# EAGLE design AVRI2CIO_V0_2_LEVEL0 (EAGLE 6.6.0)
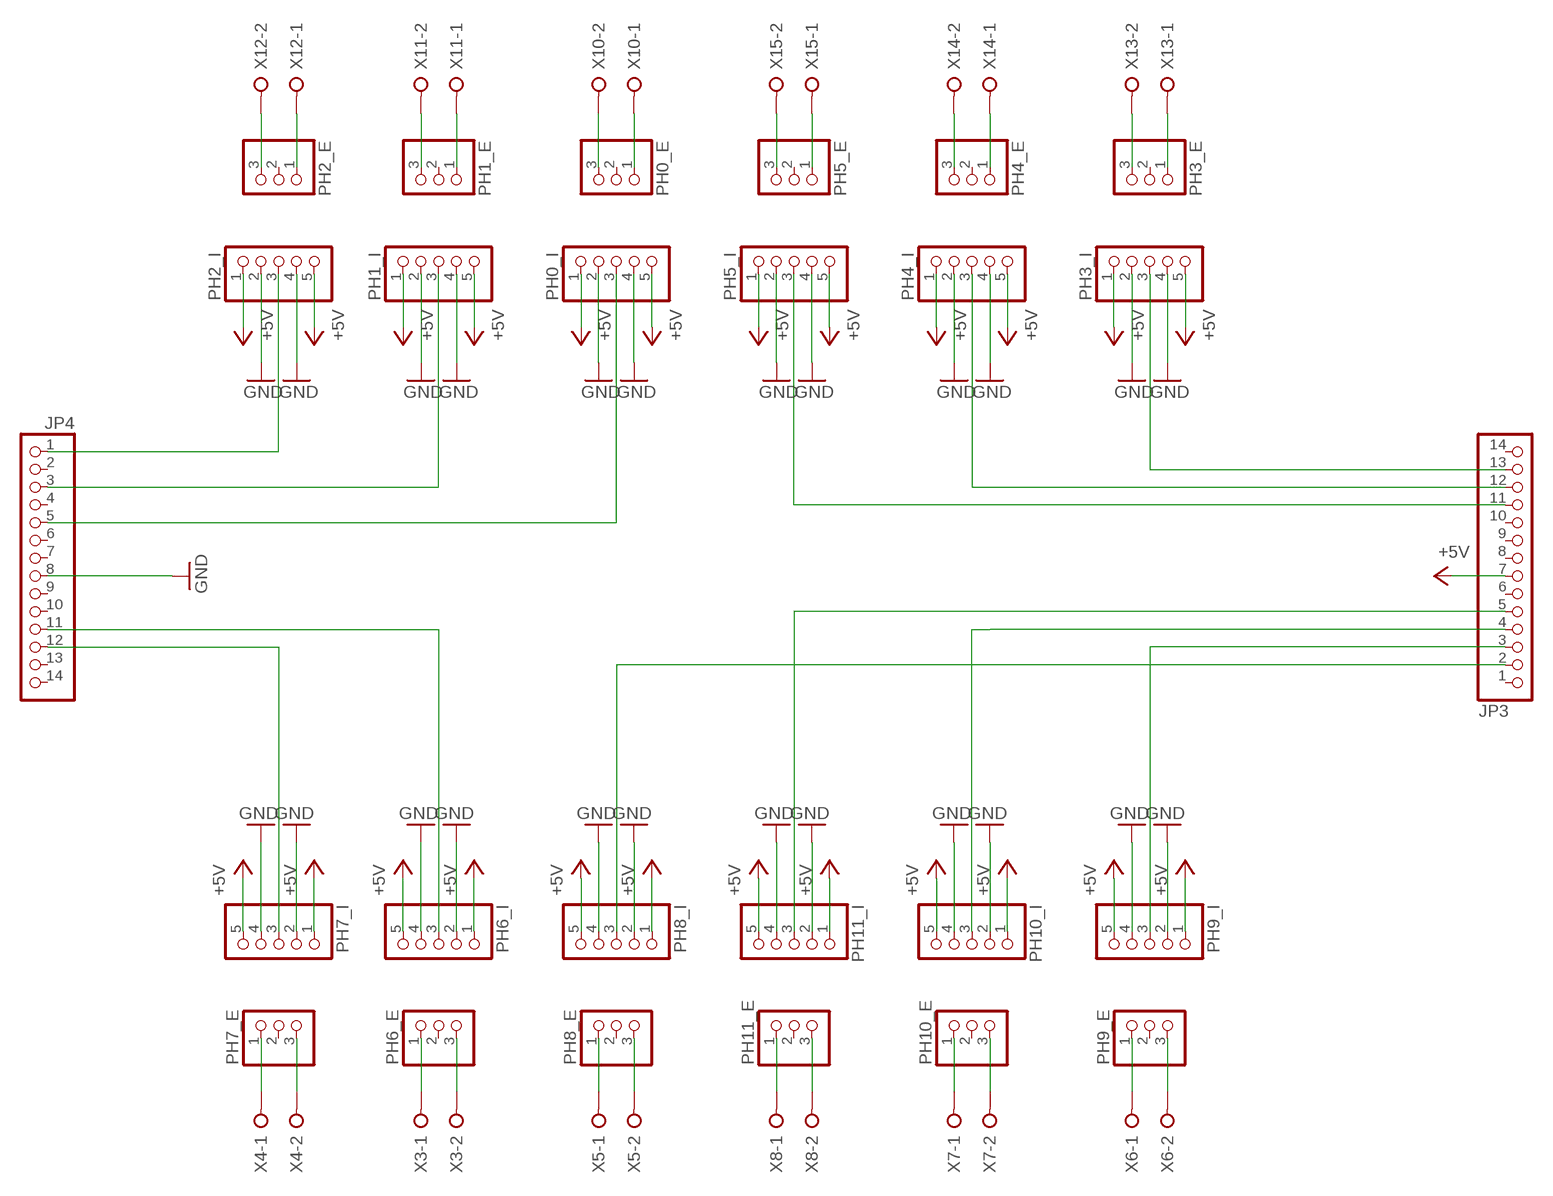
[diagram p0: schematic, sheet 1]

## Parts
JP3  PINHD-1X14  [1X14]
JP4  PINHD-1X14  [1X14]
PH0_E  PINHD-1X3  [1X03]
PH0_I  PINHD-1X5  [1X05]
PH1_E  PINHD-1X3  [1X03]
PH1_I  PINHD-1X5  [1X05]
PH2_E  PINHD-1X3  [1X03]
PH2_I  PINHD-1X5  [1X05]
PH3_E  PINHD-1X3  [1X03]
PH3_I  PINHD-1X5  [1X05]
PH4_E  PINHD-1X3  [1X03]
PH4_I  PINHD-1X5  [1X05]
PH5_E  PINHD-1X3  [1X03]
PH5_I  PINHD-1X5  [1X05]
PH6_E  PINHD-1X3  [1X03]
PH6_I  PINHD-1X5  [1X05]
PH7_E  PINHD-1X3  [1X03]
PH7_I  PINHD-1X5  [1X05]
PH8_E  PINHD-1X3  [1X03]
PH8_I  PINHD-1X5  [1X05]
PH9_E  PINHD-1X3  [1X03]
PH9_I  PINHD-1X5  [1X05]
PH10_E  PINHD-1X3  [1X03]
PH10_I  PINHD-1X5  [1X05]
PH11_E  PINHD-1X3  [1X03]
PH11_I  PINHD-1X5  [1X05]
X3  W237-02P  [W237-132]
X4  W237-02P  [W237-132]
X5  W237-02P  [W237-132]
X6  W237-02P  [W237-132]
X7  W237-02P  [W237-132]
X8  W237-02P  [W237-132]
X10  W237-02P  [W237-132]
X11  W237-02P  [W237-132]
X12  W237-02P  [W237-132]
X13  W237-02P  [W237-132]
X14  W237-02P  [W237-132]
X15  W237-02P  [W237-132]

## Nets
+5V: JP3.7 PH0_I.1 PH0_I.5 PH1_I.1 PH1_I.5 PH2_I.1 PH2_I.5 PH3_I.1 PH3_I.5 PH4_I.1 PH4_I.5 PH5_I.1 PH5_I.5 PH6_I.1 PH6_I.5 PH7_I.1 PH7_I.5 PH8_I.1 PH8_I.5 PH9_I.1 PH9_I.5 PH10_I.1 PH10_I.5 PH11_I.1 PH11_I.5
GND: JP4.8 PH0_I.2 PH0_I.4 PH1_I.2 PH1_I.4 PH2_I.2 PH2_I.4 PH3_I.2 PH3_I.4 PH4_I.2 PH4_I.4 PH5_I.2 PH5_I.4 PH6_I.2 PH6_I.4 PH7_I.2 PH7_I.4 PH8_I.2 PH8_I.4 PH9_I.2 PH9_I.4 PH10_I.2 PH10_I.4 PH11_I.2 PH11_I.4
N$1: PH0_E.3 X10.2
N$2: PH0_E.1 X10.1
N$3: PH6_E.3 X3.2
N$4: PH6_E.1 X3.1
N$5: PH7_E.3 X4.2
N$6: PH7_E.1 X4.1
N$7: PH8_E.3 X5.2
N$8: PH8_E.1 X5.1
N$9: PH9_E.3 X6.2
N$10: PH9_E.1 X6.1
N$11: PH10_E.3 X7.2
N$12: PH10_E.1 X7.1
N$13: PH11_E.3 X8.2
N$14: PH11_E.1 X8.1
N$16: JP4.12 PH7_I.3
N$17: JP3.11 PH5_I.3
N$18: JP3.3 PH9_I.3
N$19: PH1_E.1 X11.1
N$20: PH1_E.3 X11.2
N$21: JP3.2 PH8_I.3
N$22: JP3.13 PH3_I.3
N$23: PH2_E.1 X12.1
N$24: PH2_E.3 X12.2
N$25: PH3_E.1 X13.1
N$26: PH3_E.3 X13.2
N$27: PH4_E.1 X14.1
N$28: PH4_E.3 X14.2
N$29: PH5_E.1 X15.1
N$30: PH5_E.3 X15.2
N$31: JP3.12 PH4_I.3
N$32: JP4.3 PH1_I.3
N$34: JP4.11 PH6_I.3
N$35: JP4.5 PH0_I.3
N$36: JP4.1 PH2_I.3
PD3: JP3.4 PH10_I.3
PD5: JP3.5 PH11_I.3
Unconnected: JP3.1 JP3.6 JP3.8 JP3.9 JP3.10 JP3.14 JP4.2 JP4.4 JP4.6 JP4.7 JP4.9 JP4.10 JP4.13 JP4.14 PH0_E.2 PH1_E.2 PH2_E.2 PH3_E.2 PH4_E.2 PH5_E.2 PH6_E.2 PH7_E.2 PH8_E.2 PH9_E.2 PH10_E.2 PH11_E.2

## Library data of the parts
JP3 JP4 = pinhead:PINHD-1X14: PIN HEADER
PH0_E PH1_E PH2_E PH3_E PH4_E PH5_E PH6_E PH7_E PH8_E PH9_E PH10_E PH11_E = pinhead:PINHD-1X3: PIN HEADER
PH0_I PH1_I PH2_I PH3_I PH4_I PH5_I PH6_I PH7_I PH8_I PH9_I PH10_I PH11_I = pinhead:PINHD-1X5: PIN HEADER
X3-X8 X10-X15 = con-wago-508:W237-02P: WAGO SREW CLAMP; OC_FARNELL: unknown; OC_NEWARK: unknown

## Board
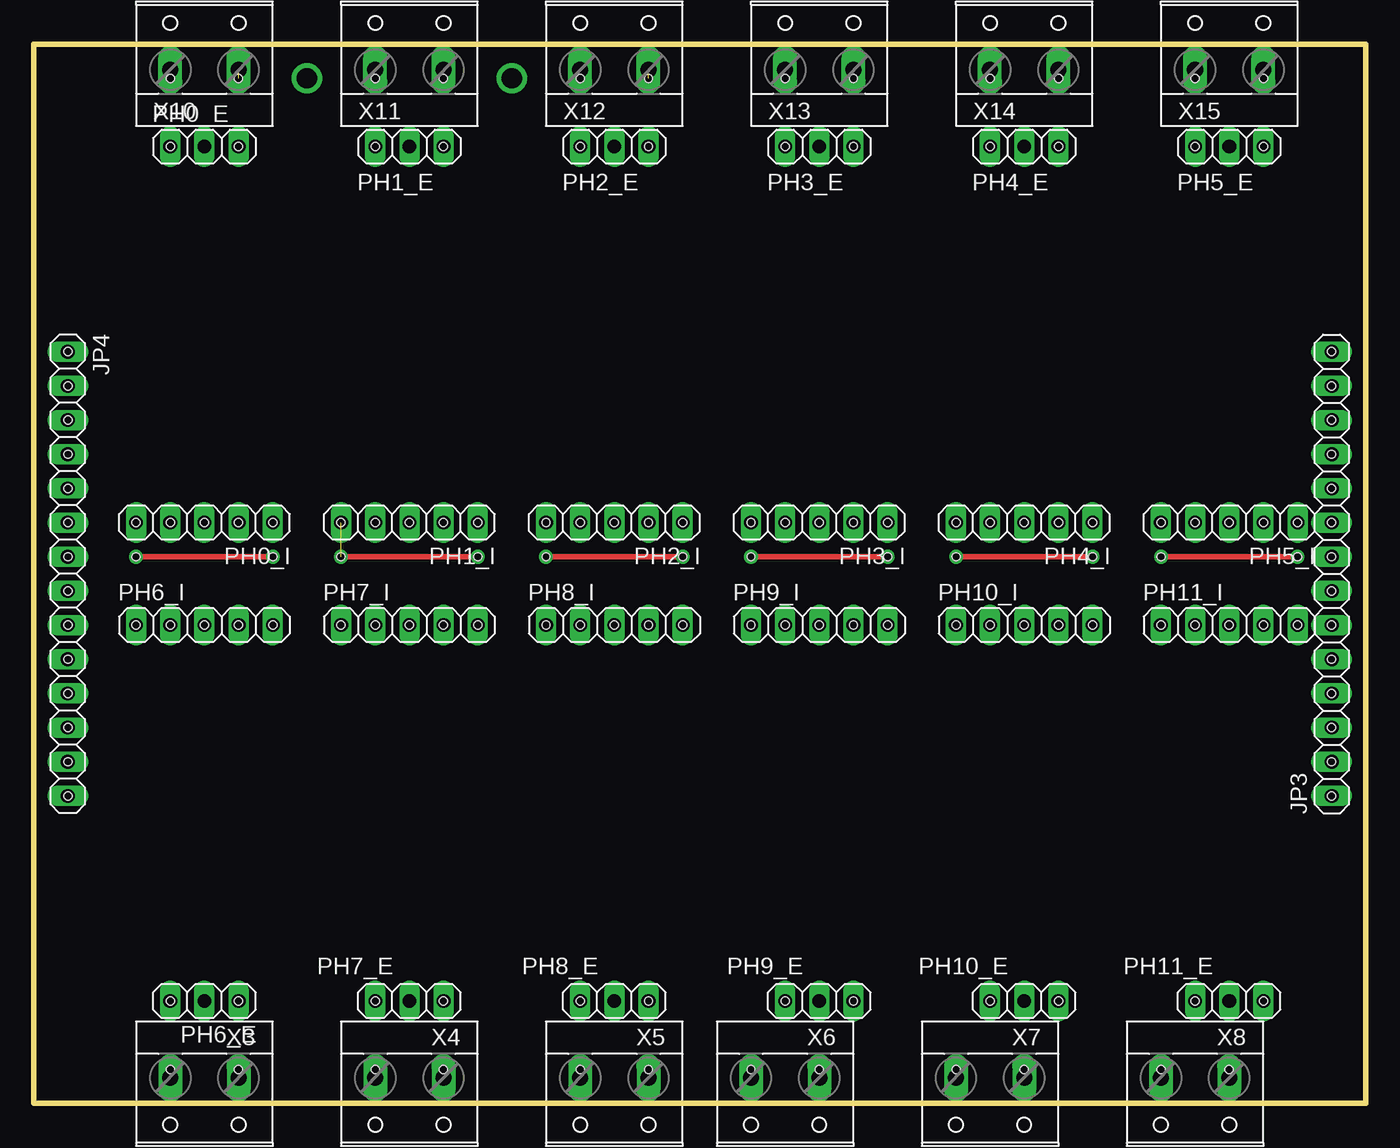
[diagram p1: board, top side]
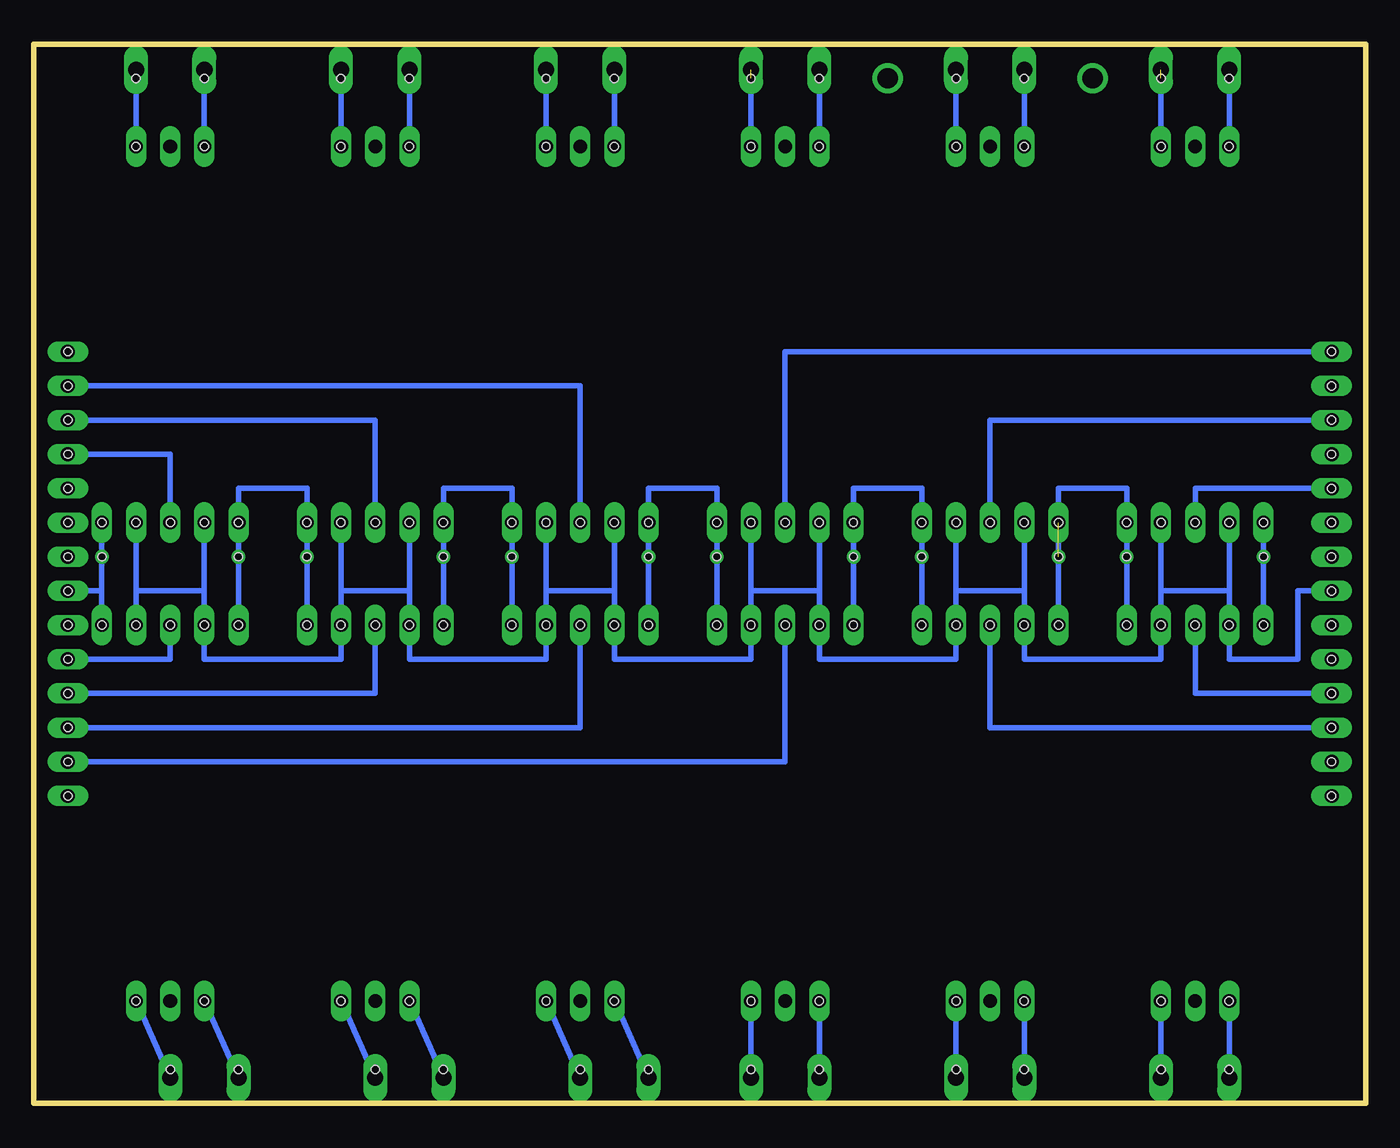
[diagram p2: board, bottom side, seen from below]

Size 99.06 x 78.74 mm. Coordinates in mm from the lower left corner, seen from the top.
Outline: 0,0 99.06,0 99.06,78.74 0,78.74 0,0
Copper layers (1*16): Top 0.035mm / dielectric 1.5mm / Bottom 0.035mm
Design rules "default": minimum track width 10mil, minimum drill 24mil, track to track 8mil, track to pad 8mil, pad to pad 8mil, via to via 8mil, smd to smd 8mil, copper to edge 40mil, drill to drill 8mil, minimum pad ring 10mil, minimum via ring 8mil, stop-mask expansion 4mil, vias tented up to drill 0mil, thermal gap 10mil
Holes 0.6 mm at 2.54,22.86 2.54,25.4 2.54,27.94 2.54,30.48 2.54,33.02 2.54,35.56 2.54,38.1 2.54,40.64 2.54,43.18 2.54,45.72 2.54,48.26 2.54,50.8 2.54,53.34 2.54,55.88 7.62,43.18 10.16,43.18 12.7,43.18 15.24,43.18 17.78,43.18 22.86,43.18 25.4,43.18 27.94,43.18 30.48,43.18 33.02,43.18 38.1,43.18 40.64,43.18 43.18,43.18 45.72,43.18 48.26,43.18 53.34,43.18 55.88,43.18 58.42,43.18 60.96,43.18 63.5,43.18 68.58,43.18 71.12,43.18 73.66,43.18 76.2,43.18 78.74,43.18 78.74,35.56 76.2,35.56 73.66,35.56 71.12,35.56 68.58,35.56 63.5,35.56 60.96,35.56 58.42,35.56 55.88,35.56 53.34,35.56 48.26,35.56 45.72,35.56 43.18,35.56 40.64,35.56 38.1,35.56 33.02,35.56 30.48,35.56 27.94,35.56 25.4,35.56 22.86,35.56 17.78,35.56 15.24,35.56 12.7,35.56 10.16,35.56 7.62,35.56 96.52,55.88 96.52,53.34 96.52,50.8 96.52,48.26 96.52,45.72 96.52,43.18 96.52,40.64 96.52,38.1 96.52,35.56 96.52,33.02 96.52,30.48 96.52,27.94 96.52,25.4 96.52,22.86 93.98,35.56 91.44,35.56 88.9,35.56 86.36,35.56 83.82,35.56 83.82,43.18 86.36,43.18 88.9,43.18 91.44,43.18 93.98,43.18 91.44,71.12 86.36,71.12 76.2,71.12 71.12,71.12 60.96,71.12 55.88,71.12 45.72,71.12 40.64,71.12 30.48,71.12 25.4,71.12 15.24,71.12 10.16,71.12 10.16,76.2 15.24,76.2 25.4,76.2 30.48,76.2 40.64,76.2 45.72,76.2 55.88,76.2 60.96,76.2 71.12,76.2 76.2,76.2 86.36,76.2 91.44,76.2 91.44,71.12 10.16,7.62 10.16,2.54 15.24,2.54 15.24,7.62 25.4,7.62 30.48,7.62 30.48,2.54 25.4,2.54 40.64,7.62 45.72,7.62 45.72,2.54 40.64,2.54 55.88,7.62 60.96,7.62 58.42,2.54 53.34,2.54 71.12,7.62 68.58,2.54 73.66,2.54 76.2,7.62 86.36,7.62 91.44,7.62 88.9,2.54 83.82,2.54 93.98,40.64 83.82,40.64 78.74,40.64 68.58,40.64 63.5,40.64 53.34,40.64 48.26,40.64 38.1,40.64 33.02,40.64 22.86,40.64 17.78,40.64 7.62,40.64

### Footprints (pad centres in the part's own frame; a part is rotated, then mirrored left to right if it is on the bottom)
1X14 = drill 1.016 long: 1 -16.51,0; 2 -13.97,0; 3 -11.43,0; 4 -8.89,0; 5 -6.35,0; 6 -3.81,0; 7 -1.27,0; 8 1.27,0; 9 3.81,0; 10 6.35,0; 11 8.89,0; 12 11.43,0; 13 13.97,0; 14 16.51,0
1X03 = drill 1.016 long: 1 -2.54,0; 2 0,0; 3 2.54,0
1X05 = drill 1.016 long: 1 -5.08,0; 2 -2.54,0; 3 0,0; 4 2.54,0; 5 5.08,0
W237-132 = drill 1.194 long: 1 -2.54,-0.635; 2 2.54,-0.635

### Placement (x,y rotation side)
DRILEGEND  [DRILEGEND]  -0.2,-6.35 0 top  (outside the outline)
JP3  96.52,39.37 90 top
JP4  2.54,39.37 270 top
PH0_E  12.7,71.12 0 top
PH0_I  12.7,43.18 180 top
PH1_E  27.94,71.12 0 top
PH1_I  27.94,43.18 180 top
PH2_E  43.18,71.12 0 top
PH2_I  43.18,43.18 180 top
PH3_E  58.42,71.12 0 top
PH3_I  58.42,43.18 180 top
PH4_E  73.66,71.12 0 top
PH4_I  73.66,43.18 180 top
PH5_E  88.9,71.12 0 top
PH5_I  88.9,43.18 180 top
PH6_E  12.7,7.62 180 top
PH6_I  12.7,35.56 0 top
PH7_E  27.94,7.62 180 top
PH7_I  27.94,35.56 0 top
PH8_E  43.18,7.62 180 top
PH8_I  43.18,35.56 0 top
PH9_E  58.42,7.62 180 top
PH9_I  58.42,35.56 0 top
PH10_E  73.66,7.62 180 top
PH10_I  73.66,35.56 0 top
PH11_E  88.9,7.62 180 top
PH11_I  88.9,35.56 0 top
X3  12.7,1.27 180 top
X4  27.94,1.27 180 top
X5  43.18,1.27 180 top
X6  55.88,1.27 180 top
X7  71.12,1.27 180 top
X8  86.36,1.27 180 top
X10  12.7,77.47 0 top
X11  27.94,77.47 0 top
X12  43.18,77.47 0 top
X13  58.42,77.47 0 top
X14  73.66,77.47 0 top
X15  88.9,77.47 0 top

### Tracks (layer width: path | path; a pad name or v marks a point on that pad's centre or on a via)
+5V  (via drill 0.6)  (1 unrouted)
  Top 0.406: v7.62,40.64 v17.78,40.64 | v22.86,40.64 v33.02,40.64 | v38.1,40.64 v48.26,40.64 | v53.34,40.64 v63.5,40.64 | v68.58,40.64 v78.74,40.64 | v83.82,40.64 v93.98,40.64
  Bottom 0.406: PH2_I.1 v48.26,40.64 PH8_I.5 48.26,45.72 53.34,45.72 PH3_I.5 v53.34,40.64 PH9_I.1 | PH3_I.1 v63.5,40.64 PH9_I.5 63.5,45.72 68.58,45.72 PH4_I.5 v68.58,40.64 PH10_I.1 | PH4_I.1 v78.74,40.64 PH10_I.5 78.74,45.72 83.82,45.72 PH5_I.5 v83.82,40.64 PH11_I.1 | PH5_I.1 v93.98,40.64 93.98,38.1 | PH1_I.1 v33.02,40.64 PH7_I.5 33.02,45.72 38.1,45.72 PH2_I.5 v38.1,40.64 PH8_I.1 | PH0_I.5 v7.62,40.64 PH6_I.1 | PH6_I.5 v17.78,40.64 PH0_I.1 17.78,45.72 22.86,45.72 v22.86,40.64 PH7_I.1 | PH11_I.5 93.98,38.1 | JP3.7 93.98,38.1
GND
  Bottom 0.406: 10.16,38.1 PH6_I.2 10.16,33.02 5.08,33.02 5.08,38.1 JP4.8 | 30.48,38.1 PH7_I.4 30.48,33.02 40.64,33.02 PH8_I.2 40.64,38.1 | 45.72,38.1 PH8_I.4 45.72,33.02 55.88,33.02 PH9_I.2 55.88,38.1 | 60.96,38.1 PH9_I.4 60.96,33.02 71.12,33.02 PH10_I.2 71.12,38.1 | PH11_I.4 91.44,38.1 | 86.36,38.1 PH11_I.2 86.36,33.02 76.2,33.02 PH10_I.4 76.2,38.1 | PH0_I.4 10.16,38.1 | PH1_I.4 25.4,38.1 | PH2_I.4 40.64,38.1 | PH3_I.4 55.88,38.1 | PH4_I.4 71.12,38.1 | PH5_I.4 86.36,38.1 | PH5_I.2 91.44,38.1 | PH0_I.2 15.24,38.1 | 15.24,38.1 PH6_I.4 15.24,33.02 25.4,33.02 PH7_I.2 25.4,38.1 | PH1_I.2 30.48,38.1 | PH2_I.2 45.72,38.1 | PH3_I.2 60.96,38.1 | PH4_I.2 76.2,38.1 | 25.4,38.1 30.48,38.1 | 40.64,38.1 45.72,38.1 | 10.16,38.1 15.24,38.1 | 55.88,38.1 60.96,38.1 | 71.12,38.1 76.2,38.1 | 86.36,38.1 91.44,38.1
N$1  (1 unrouted)
  Bottom 0.406: PH0_E.3 15.24,76.2
N$2
  Bottom 0.406: PH0_E.1 X10.1
N$3
  Bottom 0.406: X3.2 PH6_E.3
N$4
  Bottom 0.406: PH6_E.1 X3.1
N$5
  Bottom 0.406: X4.2 PH7_E.3
N$6
  Bottom 0.406: X4.1 PH7_E.1
N$7
  Bottom 0.406: X5.2 PH8_E.3
N$8
  Bottom 0.406: X5.1 PH8_E.1
N$9
  Bottom 0.406: X6.2 PH9_E.3
N$10
  Bottom 0.406: X6.1 PH9_E.1
N$11
  Bottom 0.406: X7.2 PH10_E.3
N$12
  Bottom 0.406: X7.1 PH10_E.1
N$13
  Bottom 0.406: X8.2 PH11_E.3
N$14
  Bottom 0.406: X8.1 PH11_E.1
N$16
  Bottom 0.406: JP4.12 27.94,27.94 PH7_I.3
N$17
  Bottom 0.406: PH5_I.3 88.9,48.26 JP3.11
N$18
  Bottom 0.406: JP3.3 58.42,27.94 PH9_I.3
N$19
  Bottom 0.406: PH1_E.1 X11.1
N$20
  Bottom 0.406: PH1_E.3 X11.2
N$21
  Bottom 0.406: JP3.2 43.18,25.4 PH8_I.3
N$22
  Bottom 0.406: JP3.13 58.42,53.34 PH3_I.3
N$23
  Bottom 0.406: PH2_E.1 X12.1
N$24  (1 unrouted)
  Bottom 0.406: PH2_E.3 45.72,76.2
N$25
  Bottom 0.406: PH3_E.1 X13.1
N$26
  Bottom 0.406: PH3_E.3 X13.2
N$27
  Bottom 0.406: PH4_E.1 71.12,76.2 X14.1
N$28
  Bottom 0.406: PH4_E.3 X14.2
N$29
  Bottom 0.406: PH5_E.1 X15.1
N$30
  Bottom 0.406: PH5_E.3 X15.2
N$31
  Bottom 0.406: JP3.12 73.66,50.8 PH4_I.3
N$32
  Bottom 0.406: JP4.3 27.94,50.8 PH1_I.3
N$34
  Bottom 0.406: JP4.11 12.7,30.48 PH6_I.3
N$35
  Bottom 0.406: PH0_I.3 12.7,45.72 JP4.5
N$36
  Bottom 0.406: JP4.1 43.18,55.88 PH2_I.3
N$37  (via drill 1.5)
  other vias: 20.32,76.2
N$70  (via drill 1.5)
  other vias: 35.56,76.2
PD3
  Bottom 0.406: JP3.4 73.66,30.48 PH10_I.3
PD5
  Bottom 0.406: JP3.5 88.9,33.02 PH11_I.3

### Text on the board
DrillLegend: LAYER-STACK
DrillLegend_01-16: 01-16
DrillLegend_01-20: 01-20